# EasyEDA Pro project Modular-Analog-Synthesizer.eprj, board mixer-PCB
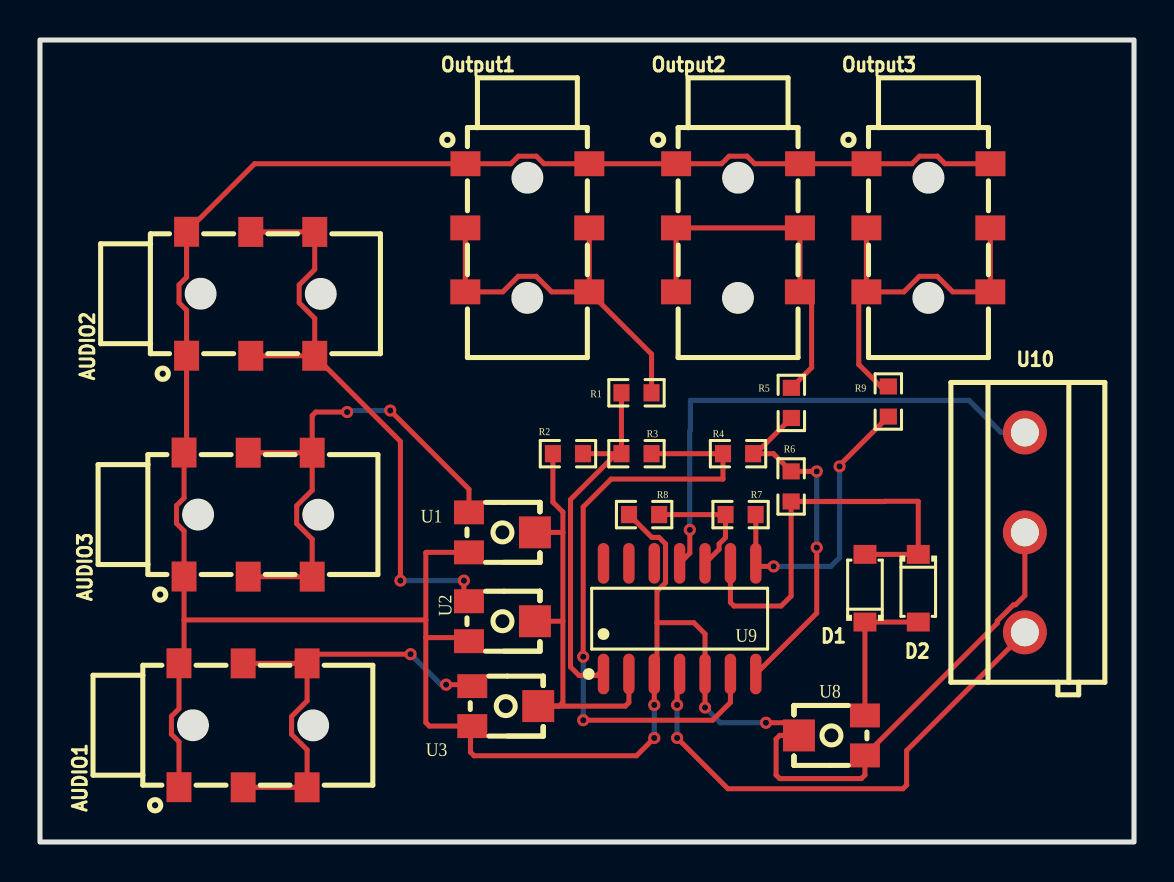
[diagram p11: board, top side]
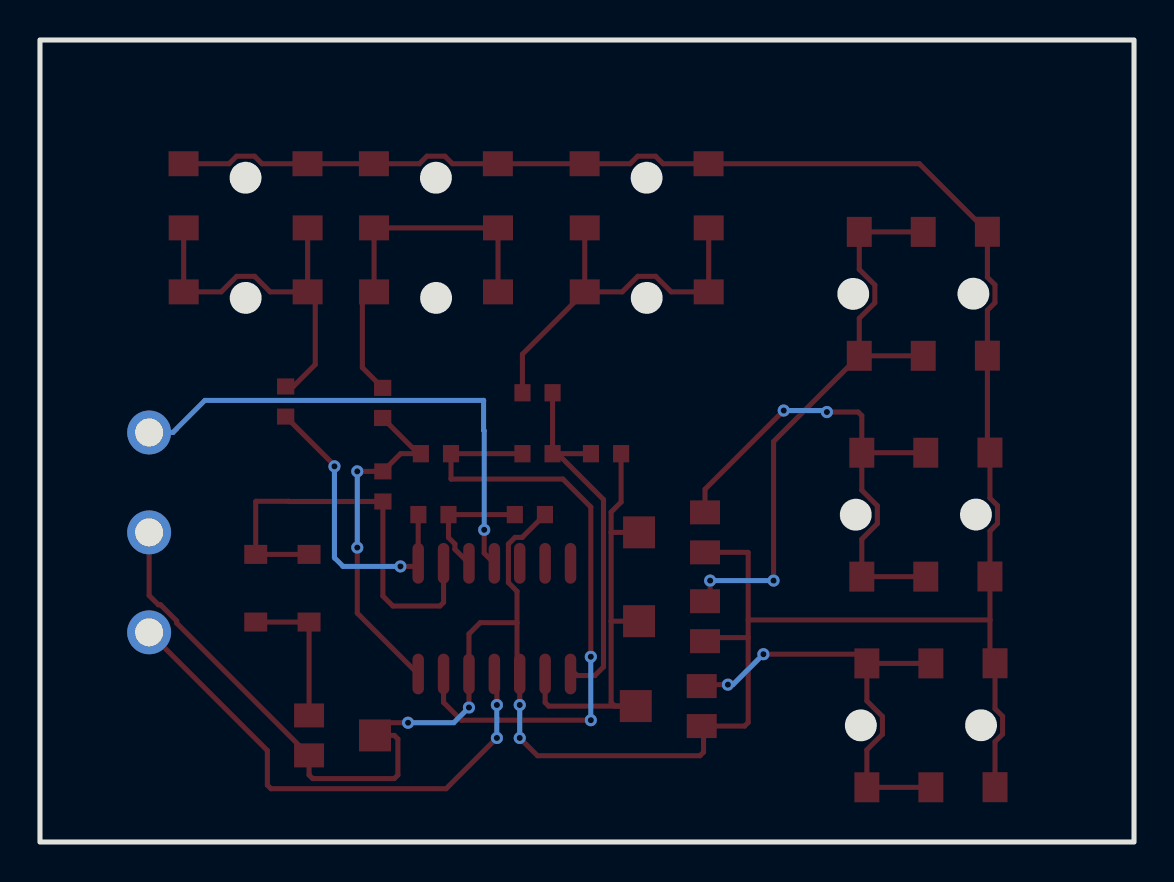
[diagram p12: board, bottom side, seen from below]

Outline 54.74 x 40.13 mm; copper layers: Top Layer, Bottom Layer. Coordinates in mm from the lower left corner of the outline.
Outline path: rectangle 0,40.13 54.74,0
Stack: Top Layer 0.035mm / Dielectric1 1.51mm FR4 er 4.5 / Bottom Layer 0.035mm

## Design rules (mm)
template: JLCPCB Capability(Two Layers Board)
spacing copperThickness1oz (default): track to track 0.102, other pairs 0.152 to 0.3
spacing copperThickness2oz: track to track 0.203, other pairs 0.152 to 0.3
track width copperThickness1oz (default): min 0.127, default 0.254, max 2.54
track width copperThickness2oz: min 0.203, default 0.254, max 2.54
differential pair differentialPair (default): width min 0.127, default 0.254, max 2.54; gap min 0.152, default 0.152
via viaSize (default): diameter min 0.5, default 0.61, max 10; hole min 0.3, default 0.305, max 6.3

## Placement (name value [footprint] x y rotation side)
AUDIO1  -  [AUDIO-SMD_PJ-313D]  10.16 5.84 90 top
AUDIO2  -  [AUDIO-SMD_PJ-313D]  10.54 27.43 90 top
AUDIO3  -  [AUDIO-SMD_PJ-313D]  10.41 16.38 90 top
D1  -  [SOD-123_L2.8-W1.8-LS3.7-RD]  41.27 12.7 90 top
D2  -  [SOD-123_L2.8-W1.8-LS3.7-RD]  43.94 12.7 270 top
Output1  -  [AUDIO-SMD_PJ-313D]  24.38 30.73 0 top
Output2  -  [AUDIO-SMD_PJ-313D]  34.92 30.73 0 top
Output3  -  [AUDIO-SMD_PJ-313D]  44.45 30.73 0 top
R1  1K  [R0603]  29.84 22.48 0 top
R2  100K  [R0603]  26.42 19.43 0 top
R3  100K  [R0603]  29.84 19.43 0 top
R4  100K  [R0603]  34.92 19.43 0 top
R5  1K  [R0603]  37.59 21.97 90 top
R6  100K  [R0603]  37.58 17.79 270 top
R7  100K  [R0603]  35.05 16.38 0 top
R8  27K  [R0603]  30.23 16.38 0 top
R9  1K  [R0603]  42.44 22.04 90 top
U1  Pot-100k  [RES-ADJ-SMD_VG039NCH]  23.11 15.49 180 top
U2  Pot-100k  [RES-ADJ-SMD_VG039NCH]  23.11 11.05 180 top
U3  Pot-100k  [RES-ADJ-SMD_VG039NCH]  23.28 6.8 180 top
U8  Pot-100k  [RES-ADJ-SMD_VG039NCH]  39.62 5.33 0 top
U9  -  [SOIC-14_L8.7-W3.9-P1.27-LS6.0-BL]  32 11.18 0 top
U10  -  [CONN-TH_3P-P5.00_KF301-5.0-3P]  49.28 15.49 270 top

## Footprints (pads in the part's own frame, mm; a bottom-side part is the same pattern mirrored in y, then rotated)
AUDIO-SMD_PJ-313D
  rect 1.501x1.25 smd: 1(-3.096,3.205) 1(3.104,3.205) 2(-3.104,-3.205) 2(3.096,-3.205) 3(-3.104,-0.005) 3(3.096,-0.005)
CONN-TH_3P-P5.00_KF301-5.0-3P
  round 2.2 hole 1.399: 1(-4.998,0) 2(0,0) 3(5.002,0)
R0603
  rect 0.806x0.864 smd: 1(-0.753,0) 2(0.753,0)
RES-ADJ-SMD_VG039NCH
  rect 1.5x1.2 smd: 1(1.65,-1) 3(1.65,1)
  rect 1.6x1.6 smd: 2(-1.65,0)
SOD-123_L2.8-W1.8-LS3.7-RD
  rect 0.95x1.15 smd: 1(-1.692,0) 2(1.692,0)
SOIC-14_L8.7-W3.9-P1.27-LS6.0-BL
  oval 0.574x2.038 smd: 1(-3.81,-2.769) 2(-2.54,-2.769) 3(-1.27,-2.769) 4(0,-2.769) 5(1.27,-2.769) 6(2.54,-2.769) 7(3.81,-2.769) 8(3.81,2.769) 9(2.54,2.769) 10(1.27,2.769) 11(0,2.769) 12(-1.27,2.769) 13(-2.54,2.769) 14(-3.81,2.769)

## Nets
As in the schematic.

Pads without a net: U9 12 13 14

## Via types
v1: diameter 0.61, hole 0.305, Top Layer to Bottom Layer, 19 vias

## Routing (per net, layer and track width the routed paths; a pad name or vN(x,y) marks a point on that pad's centre or on a via; arc(x,y) is an arc through that point)
GND: length 156.9
  Top Layer w0.254: 30.87,10.98 32.71,10.98 33.27,10.41 v1(33.27,6.73) ; 30.87,10.98 30.87,12.55 31.3,12.98 31.3,14.91 30.97,15.24 30.61,15.24 R8.1 ; 30.87,10.98 30.87,8.54 U9.3 v1(30.73,6.86) ; 19.3,10.23 21.28,10.23 U2.3 ; 19.3,10.23 19.3,5.98 19.48,5.8 U3.3 21.54,5.71 21.54,4.5 21.72,4.32 29.84,4.32 v1(30.73,5.21) ; 19.3,10.23 19.3,11.11 ; 7.21,11.11 AUDIO3.1 7.21,15.56 6.83,15.94 6.83,16.83 7.21,17.21 AUDIO3.1 7.34,19.61 AUDIO2.1 7.34,26.61 6.96,26.99 6.96,27.88 7.34,28.26 AUDIO2.1 10.74,33.94 Output1.1 23.56,33.94 23.94,34.32 24.83,34.32 25.21,33.94 Output1.1 Output2.1 34.1,33.94 34.48,34.32 35.37,34.32 35.75,33.94 Output2.1 Output3.1 43.63,33.94 44.01,34.32 44.9,34.32 45.28,33.94 47.55,33.94 ; 7.21,11.11 7.21,9.2 AUDIO1.1 6.95,6.67 6.58,6.29 6.58,5.4 6.95,5.02 AUDIO1.1 ; 7.21,11.11 19.3,11.11 ; v1(36.32,5.97) 37.34,5.97 U8.2 37.01,5.33 36.83,5.15 36.83,3.35 37.01,3.17 41.09,3.17 41.27,3.35 U8.1 47.9,10.96 47.9,11.06 48.7,11.87 48.81,11.87 49.28,12.34 U10.2 ; 19.3,11.11 19.3,14.48 19.32,14.49 U1.3
  Bottom Layer w0.254: v1(36.32,5.97) 34.04,5.97 v1(33.27,6.73) ; v1(30.73,6.86) v1(30.73,5.21)
VCC: length 26
  Top Layer w0.254: v1(31.88,5.21) 34.42,2.67 43.18,2.67 43.36,2.85 43.36,4.58 U10.3 ; v1(31.88,6.86) 31.88,8.28 U9.4
  Bottom Layer w0.254: v1(31.88,6.86) v1(31.88,5.21)
VEE: length 25.8
  Top Layer w0.254: U9.11 32.51,14.45 v1(32.51,15.62)
  Bottom Layer w0.254: v1(32.51,15.62) 32.51,20.57 32.54,20.6 32.54,22.1 46.48,22.1 48.09,20.49 U10.1
$1N266: length 25.8
  Top Layer w0.254: AUDIO3.2 AUDIO3.3 ; AUDIO3.2 13.62,21.34 13.8,21.52 v1(15.37,21.52) ; AUDIO3.2 13.62,17.6 12.84,16.83 12.84,15.93 13.62,15.15 AUDIO3.2 AUDIO3.3 ; v1(17.53,21.59) 21.46,17.65 U1.1
  Bottom Layer w0.254: v1(15.37,21.52) 15.44,21.59 v1(17.53,21.59)
$1N273: length 30.6
  Top Layer w0.254: AUDIO2.3 AUDIO2.2 ; AUDIO2.2 18.03,20.04 v1(18.03,13.08) ; AUDIO2.2 13.75,26.2 12.97,26.98 12.97,27.87 13.75,28.65 AUDIO2.2 AUDIO2.3 ; U2.1 21.21,12.3 v1(21.21,13.08)
  Bottom Layer w0.254: v1(18.03,13.08) v1(21.21,13.08)
$1N278: length 22.4
  Top Layer w0.254: U3.1 21.56,7.87 v1(20.32,7.87) ; AUDIO1.2 AUDIO1.3 ; AUDIO1.2 13.83,9.4 v1(18.54,9.4) ; AUDIO1.2 13.37,7.06 12.59,6.28 12.59,5.39 13.37,4.61 AUDIO1.2 AUDIO1.3
  Bottom Layer w0.254: v1(18.54,9.4) 20.07,7.87 v1(20.32,7.87)
$1N291: length 22.8
  Top Layer w0.254: 26.16,11.05 26.16,15.49 ; 26.16,11.05 U2.2 ; 26.16,11.05 26.16,6.98 25.98,6.81 24.93,6.81 U3.2 29.28,6.8 29.46,6.98 U9.2 ; 26.16,15.49 U1.2 ; 26.16,15.49 26.16,16.51 25.66,17.01 R2.1
$1N494: length 19.6
  Top Layer w0.254: R1.2 30.6,24.41 Output1.2 ; Output1.2 Output1.3 ; Output1.2 25.6,27.53 24.83,28.31 23.93,28.31 23.15,27.53 Output1.2 Output1.3
$1N500: length 18.7
  Top Layer w0.254: 28.84,19.43 R3.1 29.09,22.74 29.12,22.77 ; 28.84,19.43 26.54,17.14 26.54,8.76 26.98,8.33 27.86,8.33 27.94,8.41 U9.1 ; 28.84,19.43 R2.2
$1N737: length 32.2
  Top Layer w0.254: v1(27.18,6.1) 33.65,6.1 34.54,6.98 U9.6 ; R3.2 R4.1 34.17,18.17 34.16,18.16 28.58,18.16 27.18,16.76 v1(27.18,9.27)
  Bottom Layer w0.254: v1(27.18,9.27) v1(27.18,6.1)
$1N887: length 18.1
  Top Layer w0.254: R5.2 38.61,23.74 38.61,26.94 Output2.2 Output2.3 Output2.3 Output2.2
$1N893: length 17.5
  Top Layer w0.254: 35.81,19.43 36.7,19.43 37.58,18.55 v1(38.86,18.55) ; 35.81,19.43 R5.1 ; 35.81,19.43 R4.2 ; U9.7 38.86,11.45 v1(38.86,14.73)
  Bottom Layer w0.254: v1(38.86,18.55) v1(38.86,14.73)
$1N1038: length 21.7
  Top Layer w0.254: D1.2 D2.1 43.94,17.03 43.92,17.05 42.29,17.05 42.28,17.04 R6.2 37.58,12.31 37.08,11.81 34.72,11.81 34.54,11.99 U9.9
$1N1050: length 7.3
  Top Layer w0.254: U8.3 41.27,11.01 ; D1.1 D2.2
$1N1253: length 6.2
  Top Layer w0.254: R8.2 R7.1 34.3,15.23 33.98,14.91 33.98,14.65 33.27,13.95
$1N1269: length 15
  Top Layer w0.254: 42.44,21.29 40,18.85 v1(40,18.8) ; R7.2 35.81,16.37 U9.8 35.97,13.79 v1(36.7,13.79)
  Bottom Layer w0.254: v1(36.7,13.79) 39.57,13.79 40,14.22 v1(40,18.8)
$1N1360: length 19
  Top Layer w0.254: Output3.2 Output3.3 ; Output3.2 43.22,27.53 44,28.31 44.89,28.31 45.67,27.53 Output3.2 Output3.3 ; Output3.2 40.96,27.15 40.96,23.89 42.06,22.8 R9.2
